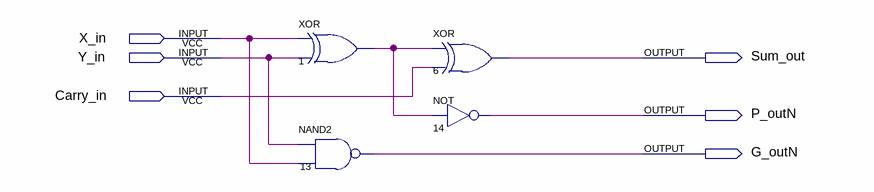
[diagram p0: schematic sheet]
// Quartus schematic partialadder1bit.bdf as structural Verilog: 4 symbols, 6 pins
module partialadder1bit (
  input  X_in,
  input  Y_in,
  input  Carry_in,
  output Sum_out,
  output P_outN,
  output G_outN
);

  wire n1_out;

  xor u_1 (n1_out, X_in, Y_in);
  nand u_13 (G_outN, Y_in, X_in);
  xor u_6 (Sum_out, n1_out, Carry_in);
  not u_14 (P_outN, n1_out);
endmodule
